# EAGLE design fd_principal (EAGLE 9.6.2)
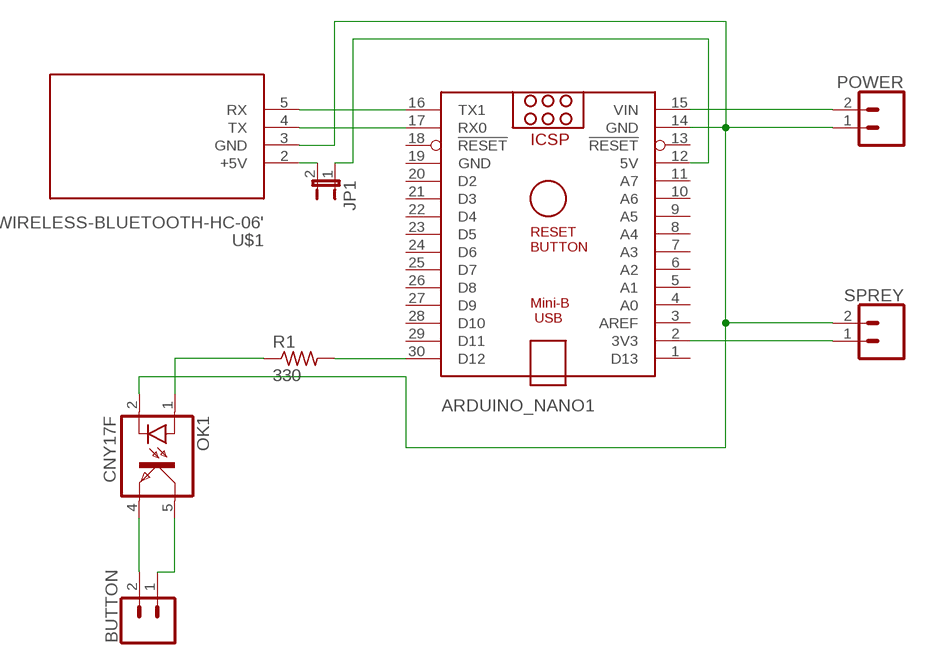
[diagram p0: schematic, sheet 1]

## Parts
ARDUINO_NANO1  ARDUINO_NANO  [ARDUINO_NANO]
BUTTON  CONN_025MM  [SCREWTERMINAL-5MM-2]
JP1  JP1E  [JP1]
OK1  CNY17F  [DIL06]
POWER  CONN_025MM  [SCREWTERMINAL-5MM-2]
R1  330  R-US_0207/10  [0207/10]
SPREY  CONN_025MM  [SCREWTERMINAL-5MM-2]
U$1  WIRELESS-BLUETOOTH-HC-06'  [WIRELESS-BLUETOOTH-HC-06]

## Nets
N$1: ARDUINO_NANO1.15(VIN) POWER.2
N$2: ARDUINO_NANO1.14(GND) OK1.2(C) POWER.1 SPREY.2 U$1.3(GND)
N$3: ARDUINO_NANO1.16(TX1) U$1.5(RX)
N$4: ARDUINO_NANO1.17(RX0) U$1.4(TX)
N$5: ARDUINO_NANO1.30(D12) R1.2
N$7: OK1.1(A) R1.1
N$8: BUTTON.2 OK1.4(EMIT)
N$9: BUTTON.1 OK1.5(COL)
N$10: ARDUINO_NANO1.2(3V3) SPREY.1
N$11: JP1.2 U$1.2(+5V)
N$13: ARDUINO_NANO1.12(5V) JP1.1
Unconnected: ARDUINO_NANO1.1(D13) ARDUINO_NANO1.3(AREF) ARDUINO_NANO1.4(A0) ARDUINO_NANO1.5(A1) ARDUINO_NANO1.6(A2) ARDUINO_NANO1.7(A3) ARDUINO_NANO1.8(A4) ARDUINO_NANO1.9(A5) ARDUINO_NANO1.10(A6) ARDUINO_NANO1.11(A7) ARDUINO_NANO1.13(!RESET) ARDUINO_NANO1.18(!RESET) ARDUINO_NANO1.20(D2) ARDUINO_NANO1.21(D3) ARDUINO_NANO1.22(D4) ARDUINO_NANO1.23(D5) ARDUINO_NANO1.24(D6) ARDUINO_NANO1.25(D7) ARDUINO_NANO1.26(D8) ARDUINO_NANO1.27(D9) ARDUINO_NANO1.28(D10) ARDUINO_NANO1.29(D11)

## Power pins joined to a net without a drawn wire
GND: ARDUINO_NANO1.19(GND)

## Library data of the parts
ARDUINO_NANO1 = ArduinoNanoV30:ARDUINO_NANO: Arduino Nano V3.0 Overview: The Arduino Nano is a small, complete, and breadboard-friendly board based on the ATmega328 (Arduino Nano 3.x) or ATmega168 (Arduino Nano 2.x). It has more or less the same functionality of the Arduino Duemilanove, but in a different package. It lacks only a DC power jack, and works with a Mini-B USB cable instead of a standard one. The Nano was designed and is being produced by Gravitech. Specifications: Microcontroller Atmel ATmega168 or ATmega328 Operating Voltage (logic level) 5 V Input Voltage (recommended) 7-12 V Input Voltage (limits) 6-20 V Digital I/O Pins 14 (of which 6 provide PWM output) Analog Input Pins 8 DC Current per I/O Pin 40 mA Flash Memory 16 KB (ATmega168) or 32 KB (ATmega328) of which 2 KB used by bootloader SRAM 1 KB (ATmega168) or 2 KB (ATmega328) EEPROM 512 bytes (ATmega168) or 1 KB (ATmega328) Clock Speed 16 MHz Dimensions 0.73" x 1.70" Length 45 mm Width 18 mm Weigth 5 g Power: The Arduino Nano can be powered via the Mini-B USB connection, 6-20V unregulated external power supply (pin 30), or 5V regulated external power supply (pin 27). The power source is automatically selected to the highest voltage source. Memory: The ATmega168 has 16 KB of flash memory for storing code (of which 2 KB is used for the bootloader); the ATmega328 has 32 KB, (also with 2 KB used for the bootloader). The ATmega168 has 1 KB of SRAM and 512 bytes of EEPROM (which can be read and written with the EEPROM library); the ATmega328 has 2 KB of SRAM and 1 KB of EEPROM. Input and Output: Each of the 14 digital pins on the Nano can be used as an input or output, using pinMode(), digitalWrite(), and digitalRead() functions. They operate at 5 volts. Each pin can provide or receive a maximum of 40 mA and has an internal pull-up resistor (disconnected by default) of 20-50 kOhms. In addition, some pins have specialized functions. Visit Arduino - ArduinoBoardNano <https://www.arduino.cc/en/Main/ArduinoBoardNano>
BUTTON POWER SPREY = SparkFun-Connectors:CONN_02: Multi connection point. Often used as Generic Header-pin footprint for 0.1 inch spaced/style header connections On any of the 0.1 inch spaced packages, you can populate with these: Break Away Headers - Straight <https://www.sparkfun.com/products/116> (PRT-00116) Break Away Male Headers - Right Angle <https://www.sparkfun.com/products/553> (PRT-00553) Female Headers <https://www.sparkfun.com/products/115> (PRT-00115) Break Away Headers - Machine Pin <https://www.sparkfun.com/products/117> (PRT-00117) Break Away Female Headers - Swiss Machine Pin <https://www.sparkfun.com/products/743> (PRT-00743) For SCREWTERMINALS and SPRING TERMINALS visit here: Screw Terimnals on SparkFun.com <https://www.sparkfun.com/search/results?term=Screw+Terminals> (5mm/3.5mm/2.54mm spacing) This device is also useful as a general connection point to wire up your design to another part of your project. Our various solder wires solder well into these plated through hole pads. Hook-Up Wire - Assortment (Stranded, 22 AWG) <https://www.sparkfun.com/products/11375> (PRT-11375) Hook-Up Wire - Assortment (Solid Core, 22 AWG) <https://www.sparkfun.com/products/11367> (PRT-11367) View the entire wire category on our website here <https://www.sparkfun.com/categories/141> Special notes: Molex polarized connector foot print use with: PRT-08233 with associated crimp pins and housings. 2.54_SCREWTERM for use with PRT-10571. 3.5mm Screw Terminal footprints for PRT-08084 5mm Screw Terminal footprints for use with PRT-08432; SF_SKU: PRT-08432
JP1 = jumper:JP1E: JUMPER
OK1 = optocoupler:CNY17F: SIEMENS OPTO COUPLER; MF: VISHAY/TELEFUNKEN; MPN: CNY17F-3; OC_FARNELL: 1469473; OC_NEWARK: 58K0172
R1 = rcl:R-US_: RESISTOR, American symbol; SPICEPREFIX: R
U$1 = diy-modules:WIRELESS-BLUETOOTH-HC-06: Bluetooth Transceiver Module based on HC-06 board Tutorial is available here: https://arduino-info.wikispaces.com/BlueTooth-HC05-HC06-Modules-How-To Click here to find device on ebay.com <http://www.ebay.com/sch/hc-05+module+rs232>

## Net classes
0 default: width 1.626 mm

## Board
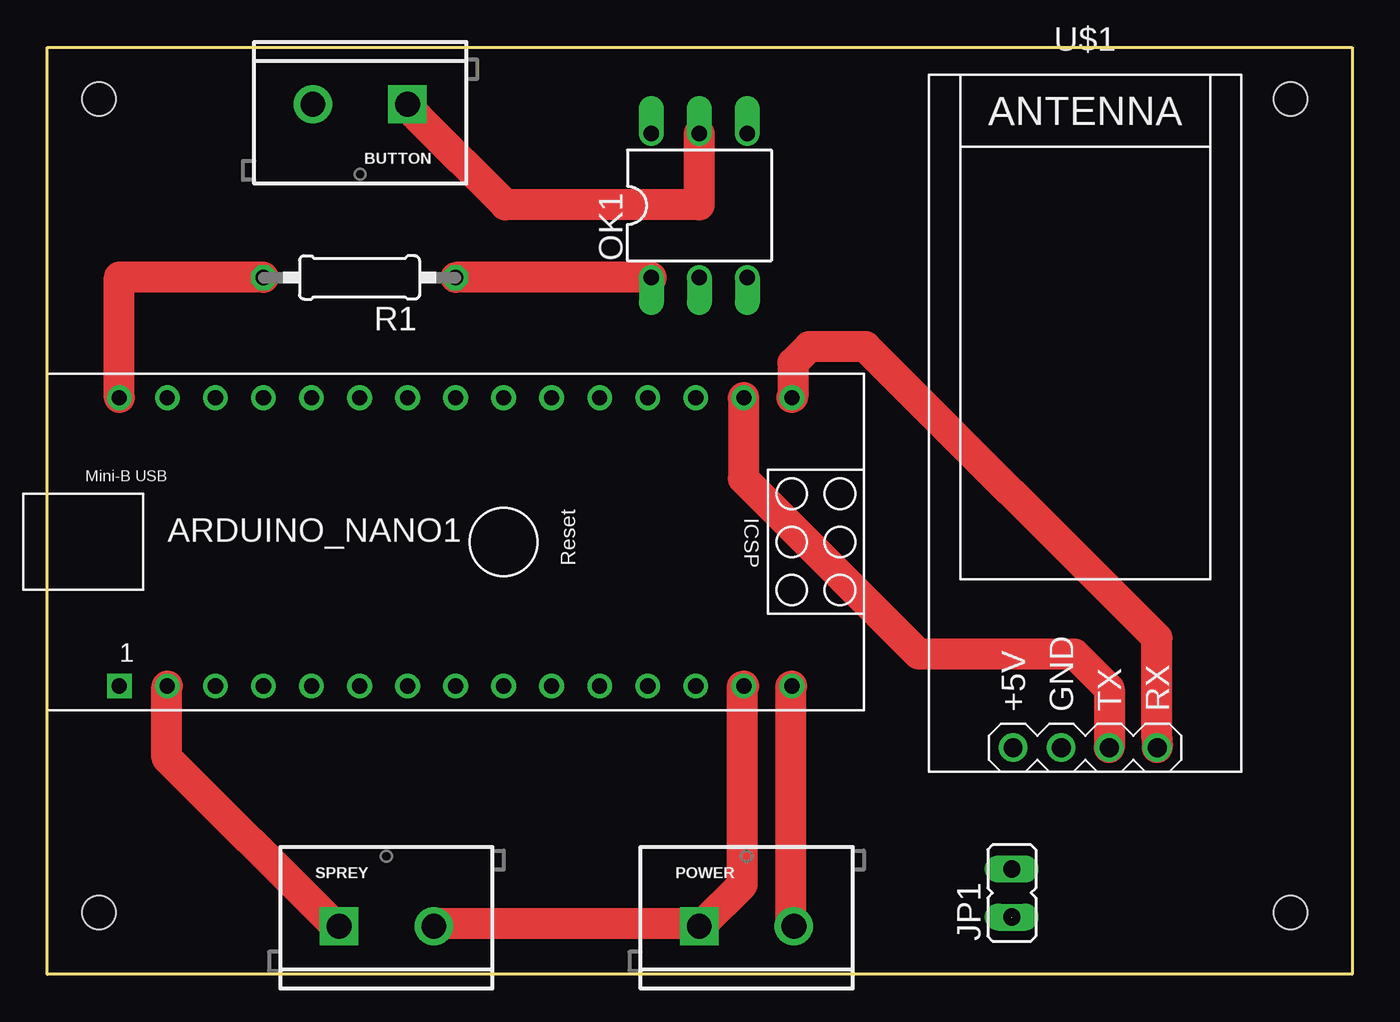
[diagram p1: board, top side]
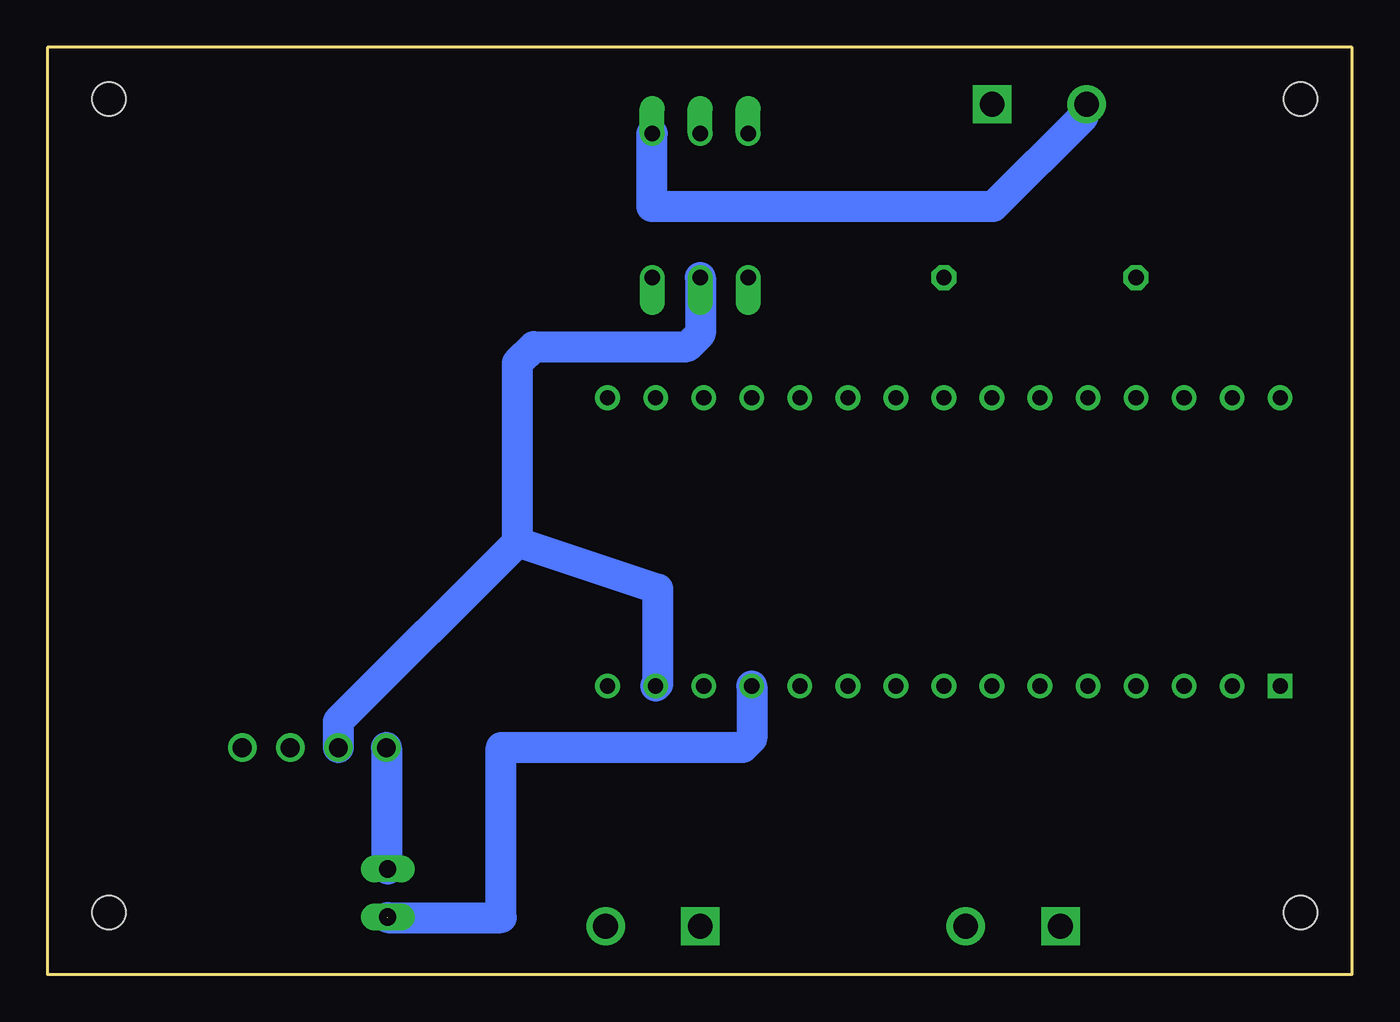
[diagram p2: board, bottom side, seen from below]

Size 69 x 49 mm. Coordinates in mm from the lower left corner, seen from the top.
Outline: 0,49 69,49 69,0 0,0 0,49
Copper layers (1*16): Top 0.035mm / dielectric 1.5mm / Bottom 0.035mm
Design rules "default": minimum track width 6mil, minimum drill 0.35mm, track to track 6mil, track to pad 6mil, pad to pad 6mil, via to via 6mil, smd to smd 6mil, copper to edge 40mil, drill to drill 6mil, minimum pad ring 10mil, minimum via ring 8mil, stop-mask expansion 4mil, vias tented up to drill 0mil, thermal gap 10mil
Holes 1.78 mm at 2.73,46.27 65.73,46.27 65.73,3.27 2.73,3.27

### Footprints (pad centres in the part's own frame; a part is rotated, then mirrored left to right if it is on the bottom)
ARDUINO_NANO = drill 0.8 square: 1 -20.32,-7.62 | drill 0.8: 2 -17.78,-7.62; 3 -15.24,-7.62; 4 -12.7,-7.62; 5 -10.16,-7.62; 6 -7.62,-7.62; 7 -5.08,-7.62; 8 -2.54,-7.62; 9 0,-7.62; 10 2.54,-7.62; 11 5.08,-7.62; 12 7.62,-7.62; 13 10.16,-7.62; 14 12.7,-7.62; 15 15.24,-7.62; 16 15.24,7.62; 17 12.7,7.62; 18 10.16,7.62; 19 7.62,7.62; 20 5.08,7.62; 21 2.54,7.62; 22 0,7.62; 23 -2.54,7.62; 24 -5.08,7.62; 25 -7.62,7.62; 26 -10.16,7.62; 27 -12.7,7.62; 28 -15.24,7.62; 29 -17.78,7.62; 30 -20.32,7.62
SCREWTERMINAL-5MM-2 = drill 1.3 pad 2.032 square: 1 0,0 | drill 1.3 pad 2.032: 2 5,0
JP1 = drill 0.914 long: 1 0,-1.27; 2 0,1.27
DIL06 = drill 0.813 offset: 1 -2.54,-3.81; 2 0,-3.81; 3 2.54,-3.81; 4 2.54,3.81; 5 0,3.81; 6 -2.54,3.81
0207/10 = drill 0.813 octagon: 1 -5.08,0; 2 5.08,0
WIRELESS-BLUETOOTH-HC-06 = drill 1: 2 -3.81,-17.145; 3 -1.27,-17.145; 4 1.27,-17.145; 5 3.81,-17.145

### Placement (x,y rotation side)
ARDUINO_NANO1  24.13,22.86 0 top
BUTTON  19.05,45.99 180 top
JP1  51,4.3 0 top
OK1  34.48,40.64 0 top
POWER  34.48,2.54 0 top
R1  16.51,36.83 180 top
SPREY  15.43,2.54 0 top
U$1  54.88,29.13 0 top

### Tracks (layer width: path | path; a pad name or v marks a point on that pad's centre or on a via)
N$1
  Top 1.626: ARDUINO_NANO1.15 39.32,15.21 39.32,2.6 POWER.2
N$2
  Top 1.626: ARDUINO_NANO1.14 36.75,15.21 36.75,4.75 34.67,2.67 POWER.1 33.78,2.67 20.45,2.67 SPREY.2
  Bottom 1.626: OK1.2 34.47,33.87 35.16,33.18 43.27,33.18 44.14,32.31 44.14,23.01 | ARDUINO_NANO1.14 36.73,15.34 36.73,20.37 44.2,22.86 44.16,22.82 53.61,13.38 U$1.3
N$3
  Top 1.626: ARDUINO_NANO1.16 39.42,30.53 39.42,32.3 40.29,33.18 43.27,33.18 58.67,17.78 58.67,12.45 U$1.5
N$4
  Top 1.626: ARDUINO_NANO1.17 36.8,30.45 36.8,26.2 46.08,16.92 54.33,16.92 56.15,15.1 U$1.4
N$5
  Top 1.626: ARDUINO_NANO1.30 3.81,36.85 11.41,36.85 R1.2
N$7
  Top 1.626: OK1.1 R1.1
N$8
  Bottom 1.626: OK1.4 37.05,44.42 37.05,40.57 18.99,40.57 14.22,45.34 BUTTON.2
N$9
  Top 1.626: OK1.5 34.48,40.67 24.23,40.67 19.56,45.34 BUTTON.1
N$10
  Top 1.626: ARDUINO_NANO1.2 6.32,15.21 6.32,11.46 15.11,2.67 SPREY.1
N$11
  Bottom 1.626: JP1.2 51.07,5.64 U$1.2
N$13  (1 unrouted)
  Bottom 1.626: 51,3 45,3 45,12 32.22,12 31.75,12.47 ARDUINO_NANO1.12